# Altium schematic sheet Pre-amp.SchDoc
size A4; SheetNumber: 2; SheetTotal: 7; ENG_APP_DATE: --/--/--; DSN_APP_DATE: --/--/--; CHK_APP_DATE: --/--/--
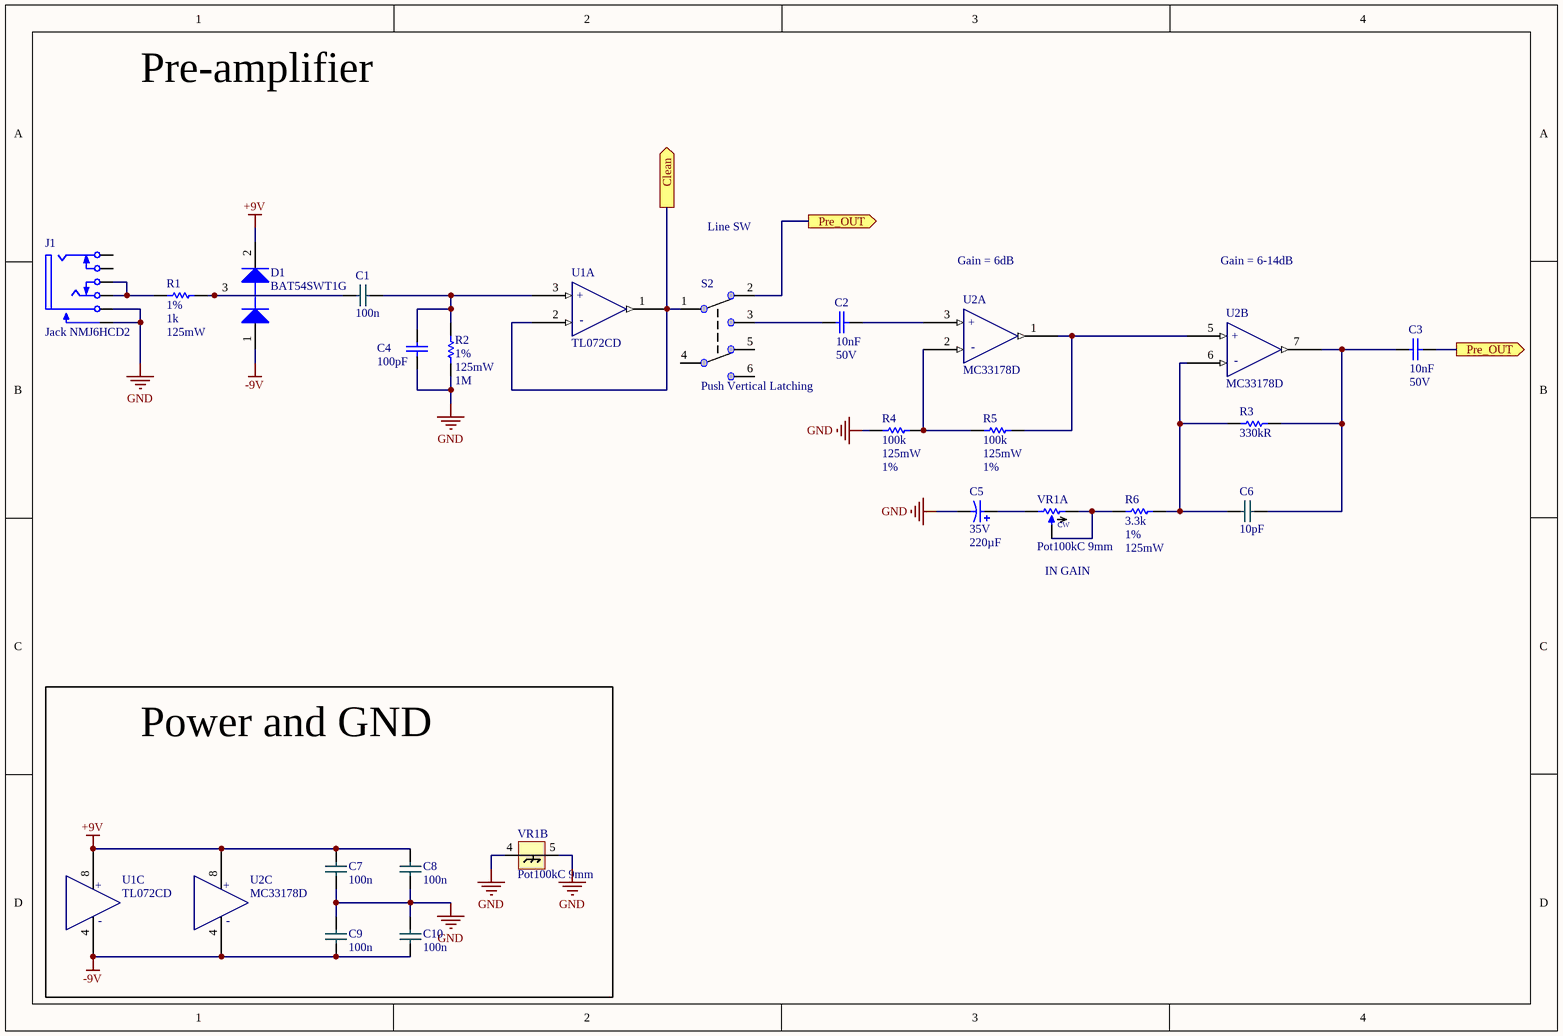
[diagram p0: Pre-amp.SchDoc]

## Parts
C1  value 100n  [0805-CAP]  (hidden comment: Cap 0805 100nF 4)
C2  Capacitance: 10nF  Rated Voltage: 50V  [0805-CAP]  (hidden comment: Cap 10nF 0805 C0G)
C3  Capacitance: 10nF  Rated Voltage: 50V  [0805-CAP]  (hidden comment: Cap 10nF 0805 C0G)
C4  Capacitance: 100pF  [0603-CAP]  (hidden comment: Cap 100pF 0603 C0G)
C5  Rated Voltage: 35V  Capacitance: 220µF  [E-CAP, SMT, diameter 10mm, height 10.2mm]  (hidden comment: Cap pol 220µF 35V)
C6  Capacitance: 10pF  [0805-CAP]  (hidden comment: cap 0805 10pF)
C7  value 100n  [0805-CAP]  (hidden comment: Cap 0805 100nF 4)
C8  value 100n  [0805-CAP]  (hidden comment: Cap 0805 100nF 4)
C9  value 100n  [0805-CAP]  (hidden comment: Cap 0805 100nF 4)
C10  value 100n  [0805-CAP]  (hidden comment: Cap 0805 100nF 4)
D1  BAT54SWT1G  [ONSC-SOT-323-3-419-04_V]
J1  Jack NMJ6HCD2  [Neutrik Jack metal nut]
R1  Tolerance (+-): 1%  Resistance: 1k  Power: 125mW  [0805-RES]  (hidden comment: Res 1k 1% 0805)
R2  Tolerance (+-): 1%  Power: 125mW  Resistance: 1M  [0805-RES]  (hidden comment: Res 1M 1% 0805)
R3  Resistance: 330kR  [0805-RES]  (hidden comment: Res 0805 330k 1%)
R4  Resistance: 100k  Power: 125mW  Tolerance (+-): 1%  [0805-RES]  (hidden comment: Res 100k 1% 0805)
R5  Resistance: 100k  Power: 125mW  Tolerance (+-): 1%  [0805-RES]  (hidden comment: Res 100k 1% 0805)
R6  Resistance: 3.3k  Tolerance (+-): 1%  Power: 125mW  [0805-RES]  (hidden comment: Res 3.3k 1% 0805)
S2  Push Vertical Latching  [PUSH VERTICAL DPDT]
U1  TL072CD  [SOIC8-127P600X175-8N]  (parts A,C of 3)
U2  MC33178D  [SOIC8-127P600X175-8N]  (parts A,B,C of 3)
VR1  Pot100kC 9mm  [LJV 9mm pot]  (parts A,B of 2)

## Blocks framed on the sheet
Power and GND: C7-C10 U1 U2 VR1

## Ports
Clean (out), Pre_OUT (out)

## Nets
+9V: C7.2 C8.2 D1.2(K) U1.8(V+) U2.8
-9V: C9.1 C10.1 D1.1(A) U1.4(V-) U2.4
GND: C4.2 C5.2 C7.1 C8.1 C9.2 C10.2 J1.1 J1.6 R2.2 R4.1 VR1.4 VR1.5
Clean: S2.1 U1.1(OUT) U1.2(IN-) ; port Clean
Pre_OUT: C3.2 S2.2 ; port Pre_OUT
NetC1_1: C1.1 D1.3(K/A) R1.2
NetC1_2: C1.2 C4.1 R2.1 U1.3(IN+)
NetC2_1: C2.1 S2.3
NetC2_2: C2.2 U2.3
NetC3_1: C3.1 C6.2 R3.2 U2.7
NetC5_1: C5.1 VR1.1(CCWPIN)
NetC6_1: C6.1 R3.1 R6.2 U2.6
NetJ1_3: J1.3 J1.4 R1.1
NetR4_2: R4.2 R5.1 U2.2
NetR5_2: R5.2 U2.1 U2.5
NetR6_1: R6.1 VR1.2(WIPER) VR1.3(CWPIN)

Not connected (* = marked no-connect by the designer): J1 2 5; S2 4 5 6

## Notes on the sheet
- Pre-amplifier
- Line SW
- Gain = 6dB
- Gain = 6-14dB
- (near VR1) IN GAIN
- Document:
- Size:
- Modified date:
- A4
- Number:
- Revision:
- Sheet
- of
- Project:
- (in symbol CMP-028-0012-7, part A) +; -
- (in symbol CMP-028-0012-7, part C) +; -
- (in symbol CMP-028-0053-5, part A) CW
- (in symbol CMP-032-0003-7, part A) +; -
- (in symbol CMP-032-0003-7, part B) +; -
- (in symbol CMP-032-0003-7, part C) +; -

## Library data of the parts
C1 C7-C10 = CMP-019-0144-11: 0.1uF 25volts C0G 5%; Source: main.SchLib; PackageDescription: Chip Capacitor; LatestRevisionNote: IPC-7351 Footprint Added.; LatestRevisionDate: 29-May-2009; Publisher: Altium Limited; Published: 8-Jun-2000; Mouser part: 81-GRM31C5C1E104JA01; Design Item ID: Cap 0805 100nF 4; PackageReference: C1206; Fitted: Fitted
C2 C3 = CMP-04096-2: Cap 10nF 0805 C0G 50V +-5%; Tolerance (+-): 5%; Dielectric: C0G; Maximum operating temperature: 125°C; Height: 950µm; Size (Imperial): 0805
C4 = CMP-04086-2: Cap 100pF 0603 C0G 50V +-5%; Tolerance (+-): 5%; Rated Voltage: 50V; Maximum operating temperature: 125°C; Height: 900µm; Size (Imperial): 0603; Dielectric: C0G
C5 = CMP-00120-4: Cap Aluminum 220uF 35V ±20% (10x10.2mm) SMD 2000h 85°C; Maximum operating temperature: 85°C; Lifetime @ Max. Temp. (hours): 2000h; + Tolerance: 20%; - Tolerance: 20%
C6 = CMP-019-0194-1: Ceramic Capacitor, Multilayer, Ceramic, 25V, 5% +Tol, 5% -Tol, C0G, -/+30ppm/Cel TC, 0.00001uF, Surface Mount, 0805; Manufacturer Series: VJ; Multilayer: Yes; JESD-609 Code: e3; Size Code: 0805; Terminal Finish: Tin; Termination: Wraparound; Negative Tolerance: 5%; Max Operating Temperature: 125°C; RoHS Compliant: Yes; REACH SVHC: Yes; Capacitor Type: Ceramic; Positive Tolerance: 5%; Mount: Surface Mount; Packaging: Tape and Reel; Package Shape: Rectangular; Dielectric Material: Ceramic; Temperature Characteristics Code: C0G; Rated DC Voltage (URdc): 25V; Min Operating Temperature: -55°C; Number of Pins: 2
D1 = CMP-055-0001-A.2: Rectifier Diode, Schottky, 2 Element, 0.2A, 30V V(RRM), Silicon; Forward Voltage: 800mV; Element Configuration: Dual; Peak Reverse Current: 2uA; Average Rectified Current: 200mA; Recovery Time: 5ns; Max Forward Surge Current (Ifsm): 600mA; Power Dissipation: 200mW; Mount: Surface Mount; REACH SVHC: No SVHC; Max Reverse Voltage (DC): 30V; Height: 0.9mm; Forward Current: 200mA; Max Repetitive Reverse Voltage (Vrrm): 30V; Lead Free: Lead Free; Max Operating Temperature: 125°C; Max Reverse Leakage Current: 2uA; Min Operating Temperature: -65°C; Number of Pins: 3; Reverse Recovery Time: 5ns; Radiation Hardening: No; Length: 2.2mm; Weight: 0.03g; Case/Package: SOT-323; Width: 1.35mm; Peak Non-Repetitive Surge Current: 600mA; Package Quantity: 1; Max Surge Current: 600mA; Packaging: Tape and Reel; Contact Plating: Tin,Matte
J1 = CMP-028-0060-3: Jack 1/4 stereo switched - PCBH - chrome nut; Manufacturer: Neutrik; Darkglass part: D00-0011; Max Current Rating: 3A; Supplied by Darkglass: YES; Voltage Rating: 50V; Number of Contacts: 2; Number of Ports: 1; Gender: Female; Orientation: Straight; Depth: 18.2mm; ComponentLink3Description: http://datasheet.octopart.com/NMJ6HCD2-Neutrik-datasheet-66533984.pdf?src-supplier=Newark; Package Quantity: 200; ComponentLink1Description: https://datasheet.ciiva.com/16148/210-217181-16148163.pdf?src-supplier=Onlinecomponents.com; Color: Black; Max Operating Temperature: 70°C; Termination: Solder; Design Item ID: Jack NMJ6HCD2; Source: main.SchLib; Mount: Through Hole; Contact Material: Chrome; Number of Terminals: 6; ComponentLink1URL: https://datasheet.ciiva.com/16148/210-217181-16148163.pdf?src-supplier=Onlinecomponents.com; Manufacturer Part Number: NMJ6HCD2; Pricing 1: 1 = 1.74000, 10 = 1.57000, 50 = 1.37000, 100 = 1.32000, 1000 = 1.24000, 10000 = 1.24000 (USD); Weight: 0.282192oz; Selective Soldering: YES; Stock 1: 16927; ComponentLink3URL: http://datasheet.octopart.com/NMJ6HCD2-Neutrik-datasheet-66533984.pdf?src-supplier=Newark; ComponentLink2Description: http://datasheet.octopart.com/NMJ6HCD2-Neutrik-datasheet-46041.pdf?src-supplier=Allied+Electronics; Housing Material: Polyamide; Contact Plating: Silver; Min Operating Temperature: -25°C; ComponentLink2URL: http://datasheet.octopart.com/NMJ6HCD2-Neutrik-datasheet-46041.pdf?src-supplier=Allied+Electronics
R1 = CMP-02472-2: Resistor 1k +-1% 0805 Thin film 0.125W +-50ppm/°C; Temperature Coefficient (ppm/°C): 50; Maximum working voltage: 150V; Composition: Thin film; Size (Imperial): 0805
R2 = CMP-02809-2: Resistor 1M +-1% 0805 Thin film 0.125W +-50ppm/°C; Maximum working voltage: 150V; Temperature Coefficient (ppm/°C): 50; Composition: Thin film; Size (Imperial): 0805
R3 = CMP-037-0126-8: 330kohm, 125mW, 1%, thin film; Temperature Coefficient: 50ppm/°C; Voltage Rating (DC): 150V; Composition: Thin Film; Case/Package: 0805; Case Code (Imperial): 0805; Case Code (Metric): 2012; ComponentLink1Description: https://datasheet.ciiva.com/5990/1392914-5990598.pdf?src-supplier=Farnell; ComponentLink1URL: https://datasheet.ciiva.com/5990/1392914-5990598.pdf?src-supplier=Farnell; ComponentLink2Description: https://datasheet.ciiva.com/5990/1392914-5990601.pdf?src-supplier=Farnell; ComponentLink2URL: https://datasheet.ciiva.com/5990/1392914-5990601.pdf?src-supplier=Farnell; ComponentLink3Description: https://datasheet.ciiva.com/2561/pyu-rt-1-to-0-05-rohs-l-5-2561162.pdf?src-supplier=Digi-Key; ComponentLink3URL: https://datasheet.ciiva.com/2561/pyu-rt-1-to-0-05-rohs-l-5-2561162.pdf?src-supplier=Digi-Key; Contact Plating: Tin; Depth: 1.25mm; Design Item ID: Res 0805 330k 1%; Height: 0.024inch; LatestRevisionDate: 17-Jul-2002; LatestRevisionNote: Re-released for DXP Platform.; Lead Free: Lead Free; Length: 0.079inch; Max Operating Temperature: 125°C; Max Power Dissipation: 125mW; Military Standard: Not; Min Operating Temperature: -55°C; Number of Pins: 2; Number of Terminations: 2; PackageDescription: Axial Device, Thru-Hole; 2 Leads; 0.5 in Pin Spacing; Package Quantity: 5000; PackageReference: AXIAL-0.5; Packaging: Tape and Reel; Power Rating: 125mW; Pricing 1: 1 = 0,10000, 10 = 0,09300, 100 = 0,03580, 1000 = 0,01573, 2500 = 0,01358 (USD); Published: 8-Jun-2000; Publisher: Altium Limited; Radiation Hardening: No; REACH SVHC: No SVHC; RoHS: Yes; Source: main.SchLib; Stock 1: 1168; Termination: SMD/SMT; Tolerance: 1%; Value: 330k; Voltage Rating: 150V; Width: 0.049inch
R4 R5 = CMP-02701-2: Resistor 100k +-1% 0805 Thin film 0.125W +-50ppm/°C; Temperature Coefficient (ppm/°C): 50; Maximum working voltage: 150V; Composition: Thin film; Size (Imperial): 0805
R6 = CMP-02529-2: Resistor 3.3k +-1% 0805 Thin film 0.125W +-50ppm/°C; Maximum working voltage: 150V; Temperature Coefficient (ppm/°C): 50; Composition: Thin film; Size (Imperial): 0805
S2 = CMP-028-0063-7: DPDT Pushbutton Latching; Manufacturer Part Number: TL2201EEXA; Darkglass part: D00-0005; Manufacturer: E-Switch; Electrical Life: 10000Cycles; Voltage Rating (DC): 30V; Supplied by Darkglass: YES; Actuator Length: 3mm; Operating Force: 2.16N; Current Rating: 100mA; Switch Function: On-On; ComponentLink2URL: https://datasheet.ciiva.com/16156/p010350f-16156301.pdf?src-supplier=Onlinecomponents.com; Termination: PC Pin; Design Item ID: Push Vertical; Source: main.SchLib; Max Voltage Rating (DC): 30V; RoHS: Yes; Orientation: Straight; Stock 1: 351; ComponentLink1URL: https://datasheet.ciiva.com/2879/p010350g-2879559.pdf?src-supplier=Digi-Key; Throw Configuration: DPDT; Lead Free: Lead Free; ComponentLink1Description: https://datasheet.ciiva.com/2879/p010350g-2879559.pdf?src-supplier=Digi-Key; Package Quantity: 700; ComponentLink2Description: https://datasheet.ciiva.com/16156/p010350f-16156301.pdf?src-supplier=Onlinecomponents.com; Contact Material: Silver; Selective Soldering: YES; Packaging: Bulk; Mount: Through Hole; Pricing 1: 1=0,70000, 10=0,66300, 25=0,63400, 50=0,60400, 100=0,58900, 250=0,57400, 500=0,54500, 1000=0,51500, 2500=0,49200, 10000=0,49200 (USD)
U1 = CMP-028-0012-7: Operational Amplifiers - Op Amps Dual Low Noise JFET SOIC8; Manufacturer 1: Texas Instruments; Operating Supply Voltage: 18V; Number of Elements: 2; Bandwidth: 3MHz; Dual Supply Voltage: 9V; Input Bias Current: 200pA; Min Dual Supply Voltage: 3.5V; Voltage Gain: 106.02dB; Max I/O Voltage: 10mV; Common Mode Rejection Ratio: 70dB; Input Offset Voltage (Vos): 3mV; Slew Rate: 13V/µs; Operating Supply Current: 1.4mA; Nominal Supply Current: 5mA; ComponentLink4URL: http://www.farnell.com/datasheets/1862384.pdf?src-supplier=Element14; ComponentLink4Description: http://www.farnell.com/datasheets/1862384.pdf?src-supplier=Element14; Manufacturer Part Number 1: TL072CD; REACH SVHC: No SVHC; Pricing 1: 1 = 0.71000, 10 = 0.59500, 50 = 0.59500, 100 = 0.38400, 1000 = 0.30700, 10000 = 0.25000 (USD); RoHS: Yes; Source: main.SchLib; ComponentLink1URL: http://www.ti.com/general/docs/lit/getliterature.tsp?genericPartNumber=TL072&&fileType=pdf&src-supplier=Avnet; Height: 1.58mm; Gain Bandwidth Product: 3MHz; ComponentLink5URL: http://focus.ti.com/lit/ds/symlink/tl074.pdf?src-supplier=Avnet+Asia; Number of Amplifiers: 2; ComponentLink2Description: https://www.distrelec.biz/Web/Downloads/_t/ds/tl07x-series_eng_tds.pdf?mime=application%2Fpdf&src-supplier=Distrelec; Radiation Hardening: No; ComponentLink3URL: http://www.ti.com/lit/ds/symlink/tl071a.pdf?src-supplier=Digi-Key; Unity Gain Bandwidth Product: 3MHz; Case/Package: D; Max Operating Temperature: 85°C; Packaging: Rail/Tube; Number of Circuits: 2; Number of Pins: 8; Length: 4.9mm; Number of Channels: 2; Package Quantity: 75; Min Operating Temperature: -40°C; Width: 3.91mm; Lead Free: Lead Free; Stock 1: 14514; ComponentLink3Description: http://www.ti.com/lit/ds/symlink/tl071a.pdf?src-supplier=Digi-Key; Nominal Gain Bandwidth Product: 3MHz; ComponentLink5Description: http://focus.ti.com/lit/ds/symlink/tl074.pdf?src-supplier=Avnet+Asia; Max Dual Supply Voltage: 18V; ComponentLink1Description: http://www.ti.com/general/docs/lit/getliterature.tsp?genericPartNumber=TL072&&fileType=pdf&src-supplier=Avnet; ComponentLink2URL: https://www.distrelec.biz/Web/Downloads/_t/ds/tl07x-series_eng_tds.pdf?mime=application%2Fpdf&src-supplier=Distrelec; Design Item ID: TL072CD
U2 = CMP-032-0003-7: IC OPAMP GP 5MHZ 8SOIC; Manufacturer: ON Semiconductor; Manufacturer Part Number: MC33178DR2G; Slew Rate: 2V/µs; Max Supply Voltage: 18V; Input Bias Current: 500nA; Number of Elements: 2; Output Current: 80mA; Nominal Supply Current: 900uA; Operating Supply Current: 1.7mA; Min Dual Supply Voltage: 2V; Common Mode Rejection Ratio: 80dB; Max Frequency: 100kHz; Input Offset Voltage (Vos): 3mV; Voltage Gain: 106.02dB; Output Current per Channel: 100mA; ComponentLink3Description: https://datasheet.ciiva.com/1796/mc33178-d-1796436.pdf?src-supplier=Digi-Key; Contact Plating: Tin; Packaging: Tape and Reel; ComponentLink4URL: https://datasheet.ciiva.com/8078/89824-8078566.pdf?src-supplier=Element14; ComponentLink1Description: https://datasheet.ciiva.com/30481/0900766b811a6563-30481352.pdf?src-supplier=RSComponents; Number of Pins: 8; Width: 0.157inch; ComponentLink6URL: https://datasheet.ciiva.com/2973/mc33178-d-2973665.pdf?src-supplier=Avnet; Nominal Gain Bandwidth Product: 5MHz; Min Operating Temperature: -40°C; Design Item ID: MC33178D; Lead Free: Lead Free; Max Dual Supply Voltage: 18V; ComponentLink9Description: https://datasheet.ciiva.com/26056/mc33178-d-26056808.pdf?src-supplier=Avnet+Europe; ComponentLink8URL: https://datasheet.ciiva.com/17068/70275428-17068423.pdf?src-supplier=Allied+Electronics; Length: 0.196inch; Gain Bandwidth Product: 5MHz; ComponentLink9URL: https://datasheet.ciiva.com/26056/mc33178-d-26056808.pdf?src-supplier=Avnet+Europe; Stock 1: 25846; Number of Channels: 2; Number of Amplifiers: 2; ComponentLink6Description: https://datasheet.ciiva.com/2973/mc33178-d-2973665.pdf?src-supplier=Avnet; ComponentLink5URL: https://datasheet.ciiva.com/48491/mc33178-d-48491755.pdf?src-supplier=Avnet; Mouser part: 863-MC33178DG; Case/Package: SOIC; Height: 0.059inch; ComponentLink5Description: https://datasheet.ciiva.com/48491/mc33178-d-48491755.pdf?src-supplier=Avnet; ComponentLink2URL: https://datasheet.ciiva.com/1796/mc33178-d-1796435.pdf?src-supplier=Digi-Key; Radiation Hardening: No; ComponentLink2Description: https://datasheet.ciiva.com/1796/mc33178-d-1796435.pdf?src-supplier=Digi-Key; ComponentLink8Description: https://datasheet.ciiva.com/17068/70275428-17068423.pdf?src-supplier=Allied+Electronics; Package Quantity: 1; ComponentLink1URL: https://datasheet.ciiva.com/30481/0900766b811a6563-30481352.pdf?src-supplier=RSComponents; Halogen Free: Halogen Free; Unity Gain Bandwidth Product: 5MHz; ComponentLink3URL: https://datasheet.ciiva.com/1796/mc33178-d-1796436.pdf?src-supplier=Digi-Key; ComponentLink4Description: https://datasheet.ciiva.com/8078/89824-8078566.pdf?src-supplier=Element14; Max Operating Temperature: 85°C; REACH SVHC: No SVHC; ComponentLink7Description: https://datasheet.ciiva.com/1796/mc33178-d-1796437.pdf?src-supplier=Digi-Key; Pricing 1: 1 = 0.86000, 10 = 0.75300, 100 = 0.57700, 500 = 0.45614, 1000 = 0.36492 (USD); ComponentLink7URL: https://datasheet.ciiva.com/1796/mc33178-d-1796437.pdf?src-supplier=Digi-Key; RoHS: Yes; Source: main.SchLib; Bandwidth: 5MHz; Number of Circuits: 2; Power Supply Rejection Ratio (PSRR): 80dB; PartId: 1
VR1 = CMP-028-0053-5: LJV 9mm pot; Darkglass part: D00-0002; Manufacturer Part Number 1: RP09110NOBA-H02-1485 (C104,KA15A6.5); Value: 100kC; Selective Soldering: YES; SET POSITION: 1; Source: main.SchLib; Design Item ID: Pot100kC 9mm; Supplied by Darkglass: YES